# Altium project MINIRACER.PrjPCB
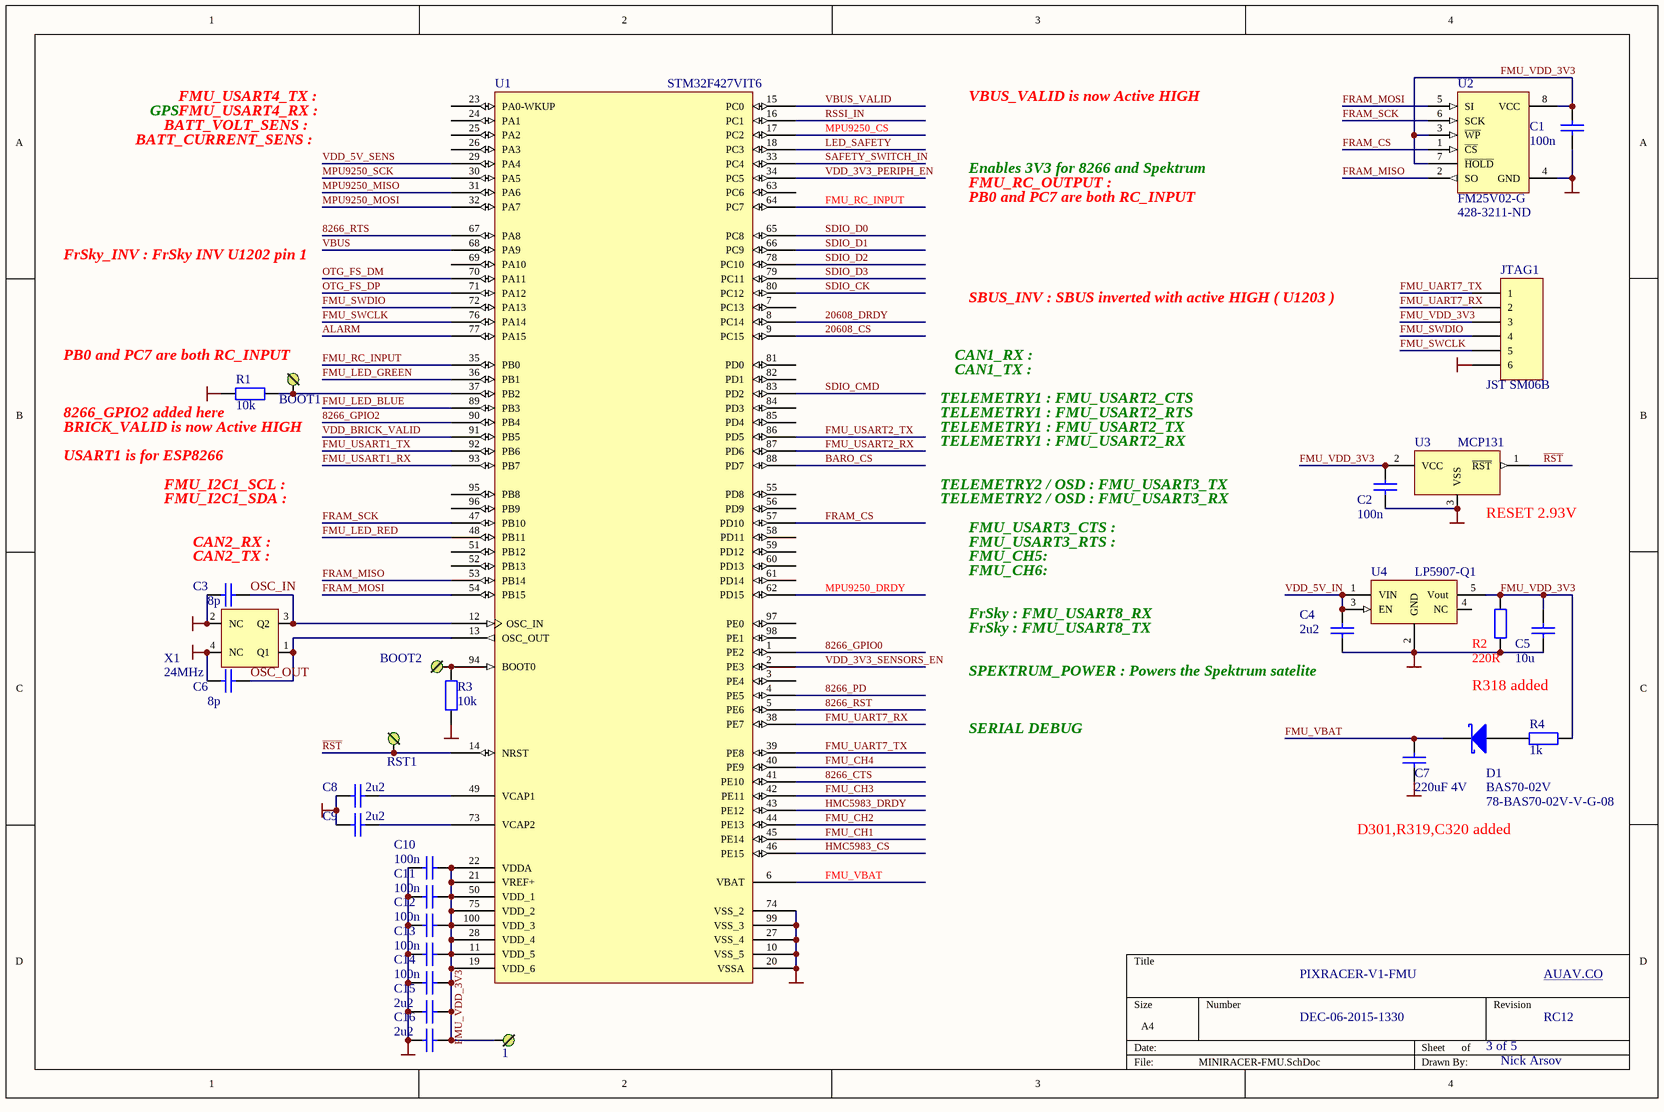
[diagram p0: MINIRACER-FMU.SchDoc]
5 sheets, 108 parts. Net scope: global (net labels, ports and power ports of the same name join across sheets).
Board file: MINIRACER.PcbDoc
Sheets:
  MINIRACER-FMU.SchDoc
  MINIRACER-IMU.SchDoc
  MINIRACER-POWER.SchDoc
  MINIRACER-SD-USB.SchDoc
  MINIRACER-SERIALS.SchDoc

## Sheet MINIRACER-FMU.SchDoc
size A4

### Parts
1  3V3  [PAD1]  (value not drawn)
BOOT1  BOOT1  [PAD1]  (value not drawn)
BOOT2  BOOT  [PAD1]  (value not drawn)
C1  100n  [0402A]
C2  100n  [0402A]
C3  8p  [0603A]
C4  2u2  [0603A]
C5  10u  [0603A]
C6  8p  [0603A]
C7  220uF 4V  [1206A]
C8  2u2  [0402A]
C9  2u2  [0402A]
C10  100n  [0402A]
C11  100n  [0402A]
C12  100n  [0402A]
C13  100n  [0402A]
C14  100n  [0402A]
C15  2u2  [0402A]
C16  2u2  [0402A]
D1  BAS70-02V  Mouser: 78-BAS70-02V-V-G-08  [SOD-523]
JTAG1  JST SM06B  [HDR1X6]
R1  10k  [0402A]
R2  220R  [0603A]
R3  10k  [0402A]
R4  1k  [0603A]
RST1  BOOT  [PAD1]  (value not drawn)
U1  STM32F427VIT6  [LQFP100_L]
U2  FM25V02-G  Supplier Part Number: 428-3211-ND  [SO-8_N]
U3  MCP131  [SOT-323]
U4  LP5907-Q1  [SOT23-5]
X1  24MHz  [Crystal_2.5x2]

### Nets
FMU_VDD_3V3: 1.1 C1.2 C2.2 C5.2 C10.2 C11.2 C12.2 C13.2 C14.2 C15.2 C16.2 JTAG1.3 R2.2 R4.1 U1.11(VDD_5) U1.19(VDD_6) U1.21(VREF+) U1.22(VDDA) U1.28(VDD_4) U1.50(VDD_1) U1.75(VDD_2) U1.100(VDD_3) U2.3(~{WP}) U2.7(~{HOLD}) U2.8(VCC) U3.2(VCC) U4.5(Vout)
GND: C1.1 C2.1 C3.1 C4.1 C5.1 C6.1 C7.1 C8.2 C9.2 C10.1 C11.1 C12.1 C13.1 C14.1 C15.1 C16.1 JTAG1.6 R1.1 R2.1 R3.2 U1.10(VSS_5) U1.20(VSSA) U1.27(VSS_4) U1.74(VSS_2) U1.99(VSS_3) U2.4(GND) U3.3(VSS) U4.2(GND) X1.2(NC) X1.4(NC)
8266_CTS: U1.41(PE10)
8266_GPIO0: U1.1(PE2)
8266_GPIO2: U1.90(PB4)
8266_PD: U1.4(PE5)
8266_RST: U1.5(PE6)
8266_RTS: U1.67(PA8)
20608_CS: U1.9(PC15)
20608_DRDY: U1.8(PC14)
~{RST}: RST1.1 U1.14(NRST) U3.1(~{RST})
ALARM: U1.77(PA15)
BARO_CS: U1.88(PD7)
FMU_CH1: U1.45(PE14)
FMU_CH2: U1.44(PE13)
FMU_CH3: U1.42(PE11)
FMU_CH4: U1.40(PE9)
FMU_LED_BLUE: U1.89(PB3)
FMU_LED_GREEN: U1.36(PB1)
FMU_LED_RED: U1.48(PB11)
FMU_RC_INPUT: U1.35(PB0) U1.64(PC7)
FMU_SWCLK: JTAG1.5 U1.76(PA14)
FMU_SWDIO: JTAG1.4 U1.72(PA13)
FMU_UART7_RX: JTAG1.2 U1.38(PE7)
FMU_UART7_TX: JTAG1.1 U1.39(PE8)
FMU_USART1_RX: U1.93(PB7)
FMU_USART1_TX: U1.92(PB6)
FMU_USART2_RX: U1.87(PD6)
FMU_USART2_TX: U1.86(PD5)
FMU_VBAT: C7.2 D1.2(K) U1.6(VBAT)
FRAM_CS: U1.57(PD10) U2.1(~{CS})
FRAM_MISO: U1.53(PB14) U2.2(SO)
FRAM_MOSI: U1.54(PB15) U2.5(SI)
FRAM_SCK: U1.47(PB10) U2.6(SCK)
HMC5983_CS: U1.46(PE15)
HMC5983_DRDY: U1.43(PE12)
LED_SAFETY: U1.18(PC3)
MPU9250_CS: U1.17(PC2)
MPU9250_DRDY: U1.62(PD15)
MPU9250_MISO: U1.31(PA6)
MPU9250_MOSI: U1.32(PA7)
MPU9250_SCK: U1.30(PA5)
OSC_IN: C3.2 U1.12(OSC_IN) X1.3(Q2)
OSC_OUT: C6.2 U1.13(OSC_OUT) X1.1(Q1)
OTG_FS_DM: U1.70(PA11)
OTG_FS_DP: U1.71(PA12)
RSSI_IN: U1.16(PC1)
SAFETY_SWITCH_IN: U1.33(PC4)
SDIO_CK: U1.80(PC12)
SDIO_CMD: U1.83(PD2)
SDIO_D0: U1.65(PC8)
SDIO_D1: U1.66(PC9)
SDIO_D2: U1.78(PC10)
SDIO_D3: U1.79(PC11)
VBUS: U1.68(PA9)
VBUS_VALID: U1.15(PC0)
VDD_3V3_PERIPH_EN: U1.34(PC5)
VDD_3V3_SENSORS_EN: U1.2(PE3)
VDD_5V_IN: C4.2 U4.1(VIN) U4.3(EN)
VDD_5V_SENS: U1.29(PA4)
VDD_BRICK_VALID: U1.91(PB5)
NetBOOT1_1: BOOT1.1 R1.2 U1.37(PB2)
NetBOOT2_1: BOOT2.1 R3.1 U1.94(BOOT0)
NetC8_1: C8.1 U1.49(VCAP1)
NetC9_1: C9.1 U1.73(VCAP2)
NetD1_1: D1.1(A) R4.2

Not connected (* = marked no-connect by the designer): U1 3(PE4) 7(PC13) 23(PA0-WKUP) 24(PA1) 25(PA2) 26(PA3) 51(PB12) 52(PB13) 55(PD8) 56(PD9) 58(PD11) 59(PD12) 60(PD13) 61(PD14) 63(PC6) 69(PA10) 81(PD0) 82(PD1) 84(PD3) 85(PD4) 95(PB8) 96(PB9) 97(PE0) 98(PE1); U4 4(NC)

### Notes on the sheet
- GPS
- FMU_USART4_TX :
- FMU_USART4_RX :
- VBUS_VALID is now Active HIGH
- BATT_CURRENT_SENS :
- BATT_VOLT_SENS :
- Enables 3V3 for 8266 and Spektrum
- FMU_RC_OUTPUT :
- FrSky_INV : FrSky INV U1202 pin 1
- PB0 and PC7 are both RC_INPUT
- SBUS_INV : SBUS inverted with active HIGH ( U1203 )
- (near BOOT1) PB0 and PC7 are both RC_INPUT
- TELEMETRY1 : FMU_USART2_CTS
- CAN1_RX :
- CAN1_TX :
- (near R1) USART1 is for ESP8266
- BRICK_VALID is now Active HIGH
- (near R1) 8266_GPIO2 added here
- TELEMETRY1 : FMU_USART2_TX
- TELEMETRY1 : FMU_USART2_RX
- TELEMETRY1 : FMU_USART2_RTS
- FMU_I2C1_SCL :
- FMU_I2C1_SDA :
- (near C3) CAN2_RX :
- TELEMETRY2 / OSD : FMU_USART3_TX
- TELEMETRY2 / OSD : FMU_USART3_RX
- FMU_USART3_CTS :
- FMU_USART3_RTS :
- (near U3) RESET 2.93V
- (near C3) CAN2_TX :
- FrSky : FMU_USART8_RX
- FMU_CH6:
- FMU_CH5:
- (near C4) SPEKTRUM_POWER : Powers the Spektrum satelite
- FrSky : FMU_USART8_TX
- R318 added
- SERIAL DEBUG
- D301,R319,C320 added
- PIXRACER-V1-FMU
- AUAV.CO
- DEC-06-2015-1330
- 3 of 5
- RC12
- Nick Arsov

### Library data of the parts
1 BOOT1 BOOT2 RST1 = PLUG
C1-C16 = Cap: Capacitor; Value: 100pF; Published: 8-Jun-2000; LatestRevisionDate: 17-Jul-2002; LatestRevisionNote: Re-released for DXP Platform.; PackageReference: RAD-0.3; Publisher: Altium Limited
  C7: PackageDescription: Radial Cap, Thru-Hole; 2 Leads; 0.3 in Pin Spacing
D1 = D Schottky: Schottky Diode; Published: 8-Jun-2000; LatestRevisionDate: 17-Jul-2002; LatestRevisionNote: Re-released for DXP Platform.; PackageReference: SMB; Publisher: Altium Limited; PackageDescription: DO-214-AA/SMB; 2 C-Bend Leads; Body 5.3 x 3.6 mm, inc. leads (LxW); Code_JEDEC: DO-214-AA
JTAG1 = Header 6: Header, 6-Pin; LatestRevisionDate: 17-Jul-2002; LatestRevisionNote: Re-released for DXP Platform.; Publisher: Altium Limited
R1-R3 = Res2: Resistor; Value: 1K; Published: 8-Jun-2000; LatestRevisionDate: 17-Jul-2002; LatestRevisionNote: Re-released for DXP Platform.; PackageReference: AXIAL-0.4; Publisher: Altium Limited; PackageDescription: Axial Device, Thru-Hole; 2 Leads; 0.4 in Pin Spacing
R4 = Res2: Resistor; Published: 8-Jun-2000; LatestRevisionDate: 17-Jul-2002; LatestRevisionNote: Re-released for DXP Platform.; PackageReference: AXIAL-0.4; Publisher: Altium Limited; PackageDescription: Axial Device, Thru-Hole; 2 Leads; 0.4 in Pin Spacing; Value: 1K
U1 = STM32F103VBT6: STM32 ARM-based 32-bit MCU with 64 Kbytes Flash, 100-pin LQFP, Industrial Temperature; Published: 30-May-2008; DatasheetVersion: rev6, Mar-2008; PackageVersion: Mar-2008; PackageReference: LQFP100; Publisher: Altium Limited; PackageDescription: 100-Pin Low-Profile Quad Flat Pack, 14 x 14 mm Body, 0.5 mm Pitch (LQFP100); ComponentLink1Description: Manufacturer Link; ComponentLink1URL: www.st.com/stm32; ComponentLink2Description: Datasheet; ComponentLink2URL: http://www.st.com/stonline/products/literature/ds/13587.pdf
U2 = AT45DB161D-MU
U3 = MCP102
X1 = Crystal_4pin: Supplier Part Number: 644-1052-1-ND

## Sheet MINIRACER-IMU.SchDoc
size A4; PageSetup: Record=PageOptions|CenterHorizontal=True|CenterVertical=True|PrintScale=0.97|XCorrection=1.00|YCorrection=1.00|PrintKind=2|BorderSize=5000000|LeftOffset=0|BottomOffset=0|Orientation=2|PaperLength=1000|PaperWidth=1000|Scale=100|PaperSource=7|PrintQuality=-4|MediaType=1|DitherType=10|PaperKind=A4|PrintScaleMode=1
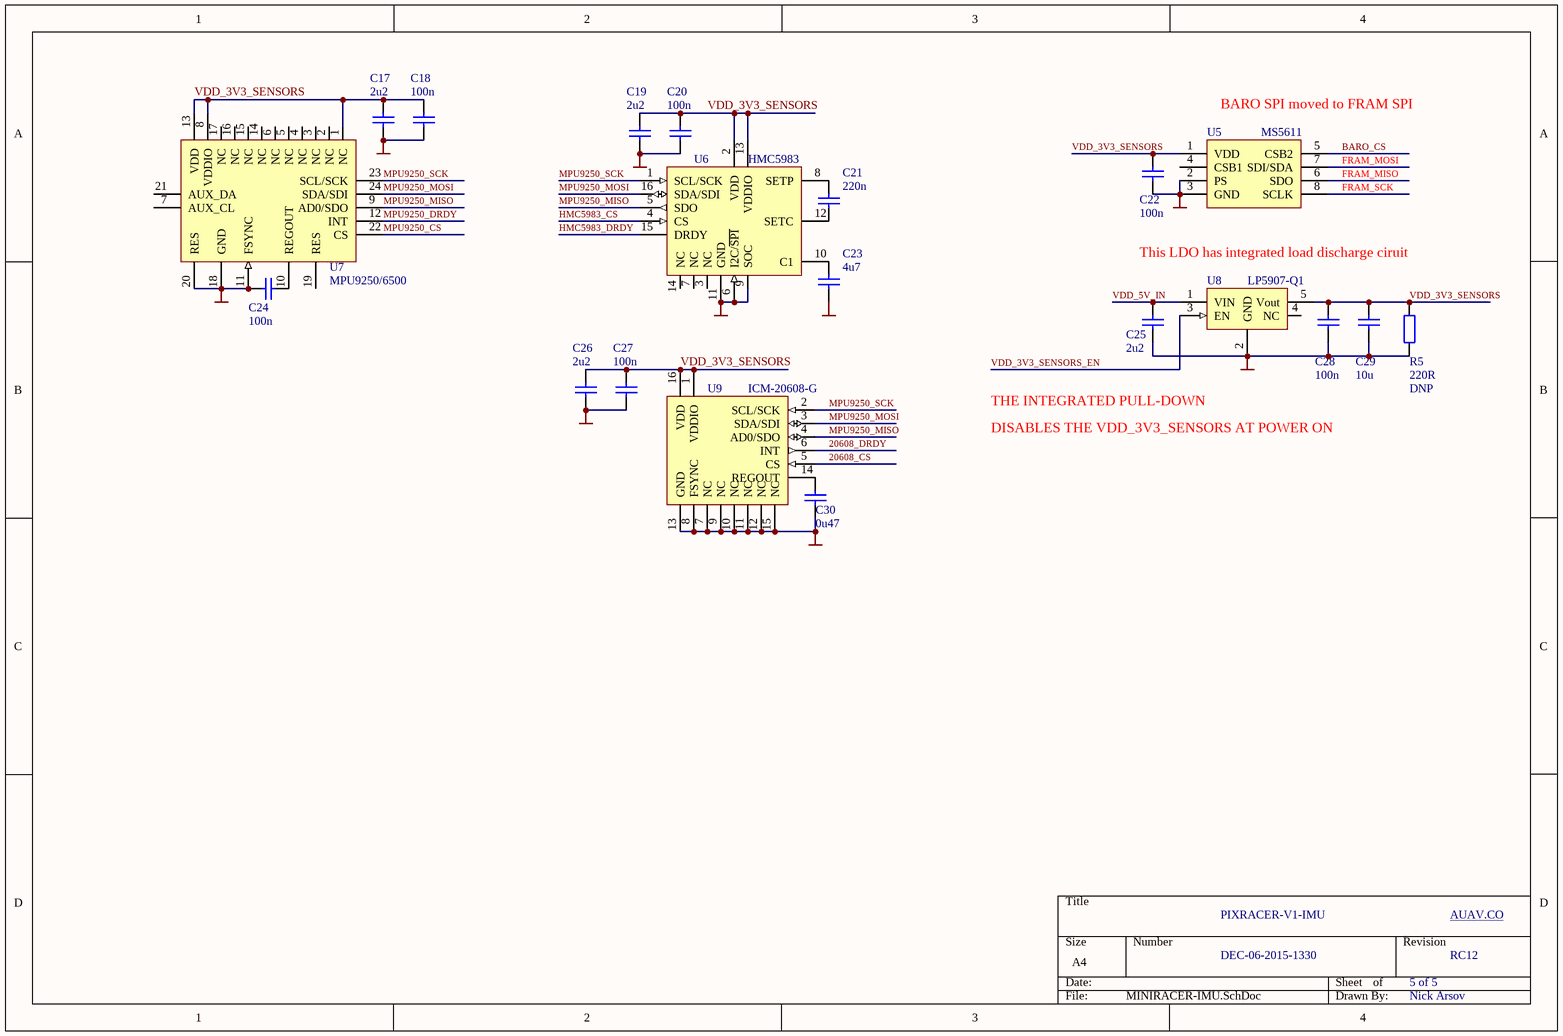
[diagram p1: MINIRACER-IMU.SchDoc]

### Parts
C17  2u2  [0402A]
C18  100n  [0402A]
C19  2u2  [0402A]
C20  100n  [0402A]
C21  220n  [0402A]
C22  100n  [0402A]
C23  4u7  [0603A]
C24  100n  [0402A]
C25  2u2  [0603A]
C26  2u2  [0402A]
C27  100n  [0402A]
C28  100n  [0603A]
C29  10u  [0603A]
C30  0u47  [0402A]
R5  220R  REM: DNP  [0402A]
U5  MS5611  [MS5611]
U6  HMC5983  [HMC5883L]
U7  MPU9250/6500  [MPU6500-9250]
U8  LP5907-Q1  [SOT23-5]
U9  ICM-20608-G  [HCLGA-16L]

### Nets
GND: C17.1 C18.1 C19.1 C20.1 C22.1 C23.1 C24.1 C25.1 C26.1 C27.1 C28.1 C29.1 C30.1 R5.1 U5.2(PS) U5.3(GND) U6.6(I2C/~{SPI}) U6.9(SOC) U6.11(GND) U7.11(FSYNC) U7.18(GND) U7.20(RES) U8.2(GND) U9.7(NC) U9.8(FSYNC) U9.9(NC) U9.10(NC) U9.11(NC) U9.12(NC) U9.13(GND) U9.15(NC)
20608_CS: U9.5(CS)
20608_DRDY: U9.6(INT)
BARO_CS: U5.5(CSB2)
FRAM_MISO: U5.6(SDO)
FRAM_MOSI: U5.7(SDI/SDA)
FRAM_SCK: U5.8(SCLK)
HMC5983_CS: U6.4(CS)
HMC5983_DRDY: U6.15(DRDY)
MPU9250_CS: U7.22(CS)
MPU9250_DRDY: U7.12(INT)
MPU9250_MISO: U6.5(SDO) U7.9(AD0/SDO) U9.4(AD0/SDO)
MPU9250_MOSI: U6.16(SDA/SDI) U7.24(SDA/SDI) U9.3(SDA/SDI)
MPU9250_SCK: U6.1(SCL/SCK) U7.23(SCL/SCK) U9.2(SCL/SCK)
VDD_3V3_SENSORS: C17.2 C18.2 C19.2 C20.2 C22.2 C26.2 C27.2 C28.2 C29.2 R5.2 U5.1(VDD) U6.2(VDD) U6.13(VDDIO) U7.1(NC) U7.8(VDDIO) U7.13(VDD) U8.5(Vout) U9.1(VDDIO) U9.16(VDD)
VDD_3V3_SENSORS_EN: U8.3(EN)
VDD_5V_IN: C25.2 U8.1(VIN)
NetC21_1: C21.1 U6.12(SETC)
NetC21_2: C21.2 U6.8(SETP)
NetC23_2: C23.2 U6.10(C1)
NetC24_2: C24.2 U7.10(REGOUT)
NetC30_2: C30.2 U9.14(REGOUT)

Not connected (* = marked no-connect by the designer): U5 4(CSB1); U6 3(NC) 7(NC) 14(NC); U7 2(NC) 3(NC) 4(NC) 5(NC) 6(NC) 7(AUX_CL) 14(NC) 15(NC) 16(NC) 17(NC) 19(RES) 21(AUX_DA); U8 4(NC)

### Notes on the sheet
- (near U5) BARO SPI moved to FRAM SPI
- This LDO has integrated load discharge ciruit
- THE INTEGRATED PULL-DOWN
- DISABLES THE VDD_3V3_SENSORS AT POWER ON
- PIXRACER-V1-IMU
- AUAV.CO
- DEC-06-2015-1330
- 5 of 5
- RC12
- Nick Arsov

### Library data of the parts
C17-C30 = Cap: Capacitor; Value: 100pF; Published: 8-Jun-2000; LatestRevisionDate: 17-Jul-2002; LatestRevisionNote: Re-released for DXP Platform.; PackageReference: RAD-0.3; Publisher: Altium Limited
R5 = Res2: Resistor; Value: 1K; Published: 8-Jun-2000; LatestRevisionDate: 17-Jul-2002; LatestRevisionNote: Re-released for DXP Platform.; PackageReference: AXIAL-0.4; Publisher: Altium Limited; PackageDescription: Axial Device, Thru-Hole; 2 Leads; 0.4 in Pin Spacing
U5 = MS5611-01BA03
U7 = MPU6500

## Sheet MINIRACER-POWER.SchDoc
size A4
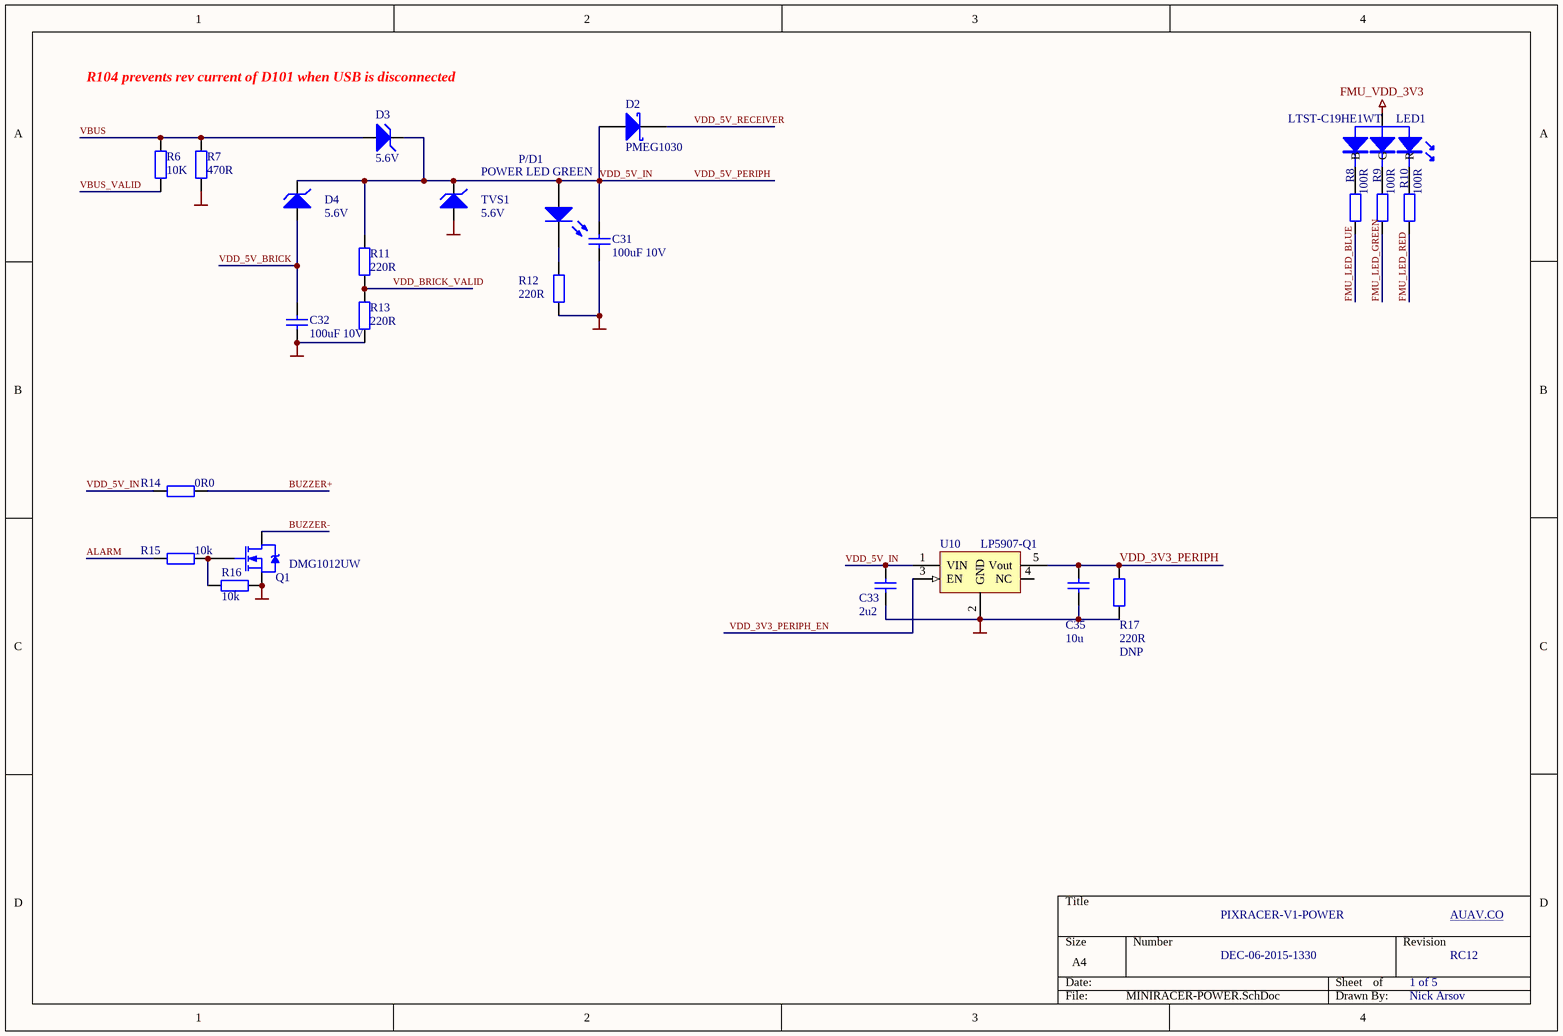
[diagram p2: MINIRACER-POWER.SchDoc]

### Parts
C31  100uF 10V  [0805A]
C32  100uF 10V  [0805A]
C33  2u2  [0603A]
C35  10u  [0603A]
D2  PMEG1030  [sod323f]
D3  5.6V  [SOD123F]
D4  5.6V  [SOD123F]
LED1  LTST-C19HE1WT  [LTST-C19HE1WT]
P/D1  POWER LED GREEN  [0603A]
Q1  DMG1012UW  [2N7002-SOT323]
R6  10K  [0603A]
R7  470R  [0603A]
R8  100R  [0402A]
R9  100R  [0402A]
R10  100R  [0402A]
R11  220R  [0603A]
R12  220R  [0603A]
R13  220R  [0603A]
R14  0R0  [0402A]
R15  10k  [0402A]
R16  10k  [0402A]
R17  220R  REM: DNP  [0402A]
TVS1  5.6V  [SOD123F]
U10  LP5907-Q1  [SOT23-5]

### Nets
FMU_VDD_3V3: LED1.4(A)
GND: C31.1 C32.1 C33.1 C35.1 Q1.2(S) R7.1 R12.1 R13.2 R16.2 R17.1 TVS1.1(A) U10.2(GND)
ALARM: R15.2
BUZZER+: R14.1
BUZZER-: Q1.1(D)
FMU_LED_BLUE: R8.1
FMU_LED_GREEN: R9.1
FMU_LED_RED: R10.1
VBUS: D3.1(A) R6.2 R7.2
VBUS_VALID: R6.1
VDD_3V3_PERIPH: C35.2 R17.2 U10.5(Vout)
VDD_3V3_PERIPH_EN: U10.3(EN)
VDD_5V_BRICK: C32.2 D4.1(A)
VDD_5V_IN: C31.2 C33.2 D2.1(A) D3.2(K) D4.2(K) P/D1.1(A) R11.1 R14.2 TVS1.2(K) U10.1(VIN)  [also labelled VDD_5V_PERIPH]
VDD_5V_RECEIVER: D2.2(K)
VDD_BRICK_VALID: R11.2 R13.1
NetLED1_1: LED1.1(R) R10.2
NetLED1_2: LED1.2(G) R9.2
NetLED1_3: LED1.3(B) R8.2
NetP/D1_2: P/D1.2(K) R12.2
NetQ1_3: Q1.3(G) R15.1 R16.1

Not connected (* = marked no-connect by the designer): U10 4(NC)

### Notes on the sheet
- R104 prevents rev current of D101 when USB is disconnected
- PIXRACER-V1-POWER
- AUAV.CO
- DEC-06-2015-1330
- 1 of 5
- RC12
- Nick Arsov

### Library data of the parts
C31-C33 C35 = Cap: Capacitor; Value: 100pF; Published: 8-Jun-2000; LatestRevisionDate: 17-Jul-2002; LatestRevisionNote: Re-released for DXP Platform.; PackageReference: RAD-0.3; Publisher: Altium Limited
  C31 C32: PackageDescription: Radial Cap, Thru-Hole; 2 Leads; 0.3 in Pin Spacing
D2 = D Schottky: Schottky Diode; Published: 8-Jun-2000; LatestRevisionDate: 17-Jul-2002; LatestRevisionNote: Re-released for DXP Platform.; PackageReference: SMB; Publisher: Altium Limited; PackageDescription: DO-214-AA/SMB; 2 C-Bend Leads; Body 5.3 x 3.6 mm, inc. leads (LxW); Code_JEDEC: DO-214-AA
D3 D4 TVS1 = D Zener: Zener Diode; Published: 8-Jun-2000; LatestRevisionDate: 17-Jul-2002; LatestRevisionNote: Re-released for DXP Platform.; PackageReference: DIODE-0.7; Publisher: Altium Limited; PackageDescription: Diode, Thru-Hole; 2 Leads; 0.7 in Pin Spacing
LED1 = RGB_LED_5MM
P/D1 = LED0: Typical INFRARED GaAs LED; Published: 8-Jun-2000; LatestRevisionDate: 08-Jul-2005; LatestRevisionNote: Mech Layer 1 removed.; PackageReference: LED-0; Publisher: Altium Limited; PackageDescription: LED; 2 Leads
Q1 = NMOS-2: N-Channel Power MOSFET; Note: Pin 2 is electrically connected to pin 4.; Published: 8-Jun-2000; LatestRevisionDate: 17-Jul-2002; LatestRevisionNote: Re-released for DXP Platform.; DatasheetDocument: PD-9.814; PackageReference: TO-220AB; Publisher: Altium Limited; Code_JEDEC: TO-220-AB; ComponentLink1Description: Manufacturer Link; ComponentLink1URL: http://www.irf.com/
R6-R17 = Res2: Resistor; Value: 1K; Published: 8-Jun-2000; LatestRevisionDate: 17-Jul-2002; LatestRevisionNote: Re-released for DXP Platform.; PackageReference: AXIAL-0.4; Publisher: Altium Limited
  R6 R7 R11-R17: PackageDescription: Axial Device, Thru-Hole; 2 Leads; 0.4 in Pin Spacing

## Sheet MINIRACER-SD-USB.SchDoc
size A4
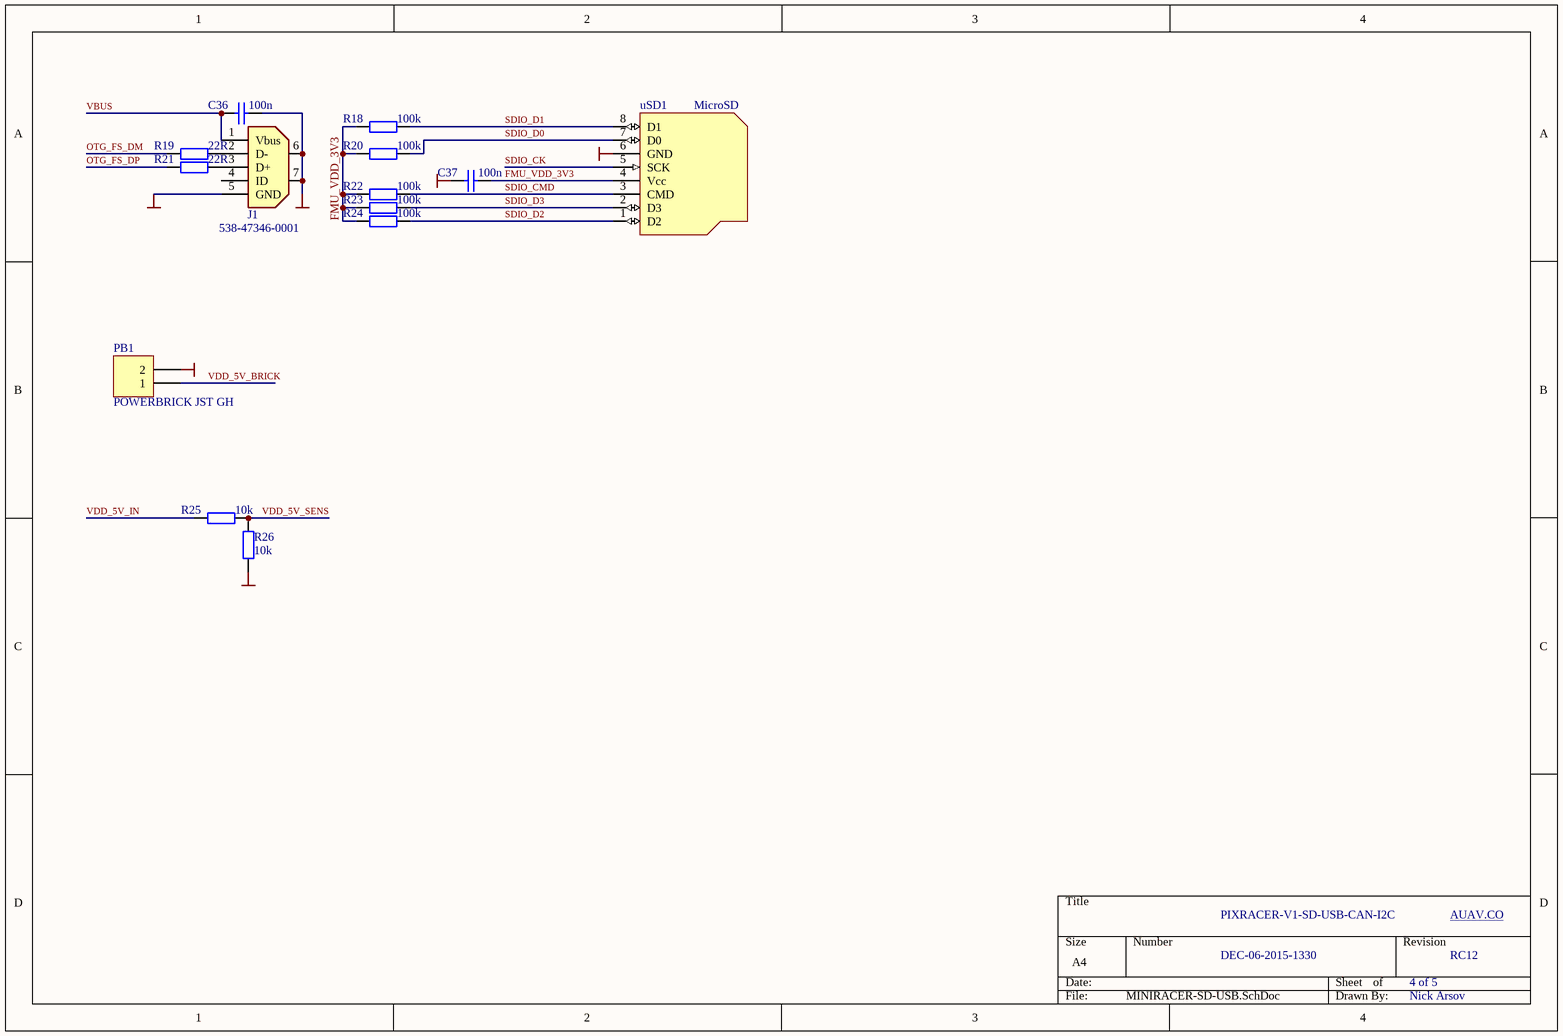
[diagram p3: MINIRACER-SD-USB.SchDoc]

### Parts
C36  100n  [0402A]
C37  100n  [0402A]
J1  Mouser Part Number: 538-47346-0001  [USBmicro_B]  (hidden comment: miniUSB)
PB1  POWERBRICK JST GH  [HDR1X2]
R18  100k  [0402A]
R19  22R  [0402A]
R20  100k  [0402A]
R21  22R  [0402A]
R22  100k  [0402A]
R23  100k  [0402A]
R24  100k  [0402A]
R25  10k  [0402A]
R26  10k  [0402A]
uSD1  MicroSD  [MicroSD_China_01]

### Nets
FMU_VDD_3V3: C37.1 R18.2 R20.2 R22.2 R23.2 R24.2 uSD1.4(Vcc)
GND: C36.1 C37.2 J1.5(GND) J1.6(GND) J1.7(GND) PB1.2 R26.2 uSD1.6(GND)
OTG_FS_DM: R19.2
OTG_FS_DP: R21.2
SDIO_CK: uSD1.5(SCK)
SDIO_CMD: R22.1 uSD1.3(CMD)
SDIO_D0: R20.1 uSD1.7(D0)
SDIO_D1: R18.1 uSD1.8(D1)
SDIO_D2: R24.1 uSD1.1(D2)
SDIO_D3: R23.1 uSD1.2(D3)
VBUS: C36.2 J1.1(Vbus)
VDD_5V_BRICK: PB1.1
VDD_5V_IN: R25.2
VDD_5V_SENS: R25.1 R26.1
NetJ1_2: J1.2(D-) R19.1
NetJ1_3: J1.3(D+) R21.1

Not connected (* = marked no-connect by the designer): J1 4(ID)

### Notes on the sheet
- PIXRACER-V1-SD-USB-CAN-I2C
- AUAV.CO
- DEC-06-2015-1330
- 4 of 5
- RC12
- Nick Arsov

### Library data of the parts
C36 C37 = Cap: Capacitor; Value: 100pF; Published: 8-Jun-2000; LatestRevisionDate: 17-Jul-2002; LatestRevisionNote: Re-released for DXP Platform.; PackageReference: RAD-0.3; Publisher: Altium Limited
J1 = MicroUSB
PB1 = Header 2: Header, 2-Pin; LatestRevisionDate: 17-Jul-2002; LatestRevisionNote: Re-released for DXP Platform.; Publisher: Altium Limited
R18-R26 = Res2: Resistor; Value: 1K; Published: 8-Jun-2000; LatestRevisionDate: 17-Jul-2002; LatestRevisionNote: Re-released for DXP Platform.; PackageReference: AXIAL-0.4; Publisher: Altium Limited; PackageDescription: Axial Device, Thru-Hole; 2 Leads; 0.4 in Pin Spacing

## Sheet MINIRACER-SERIALS.SchDoc
size A4
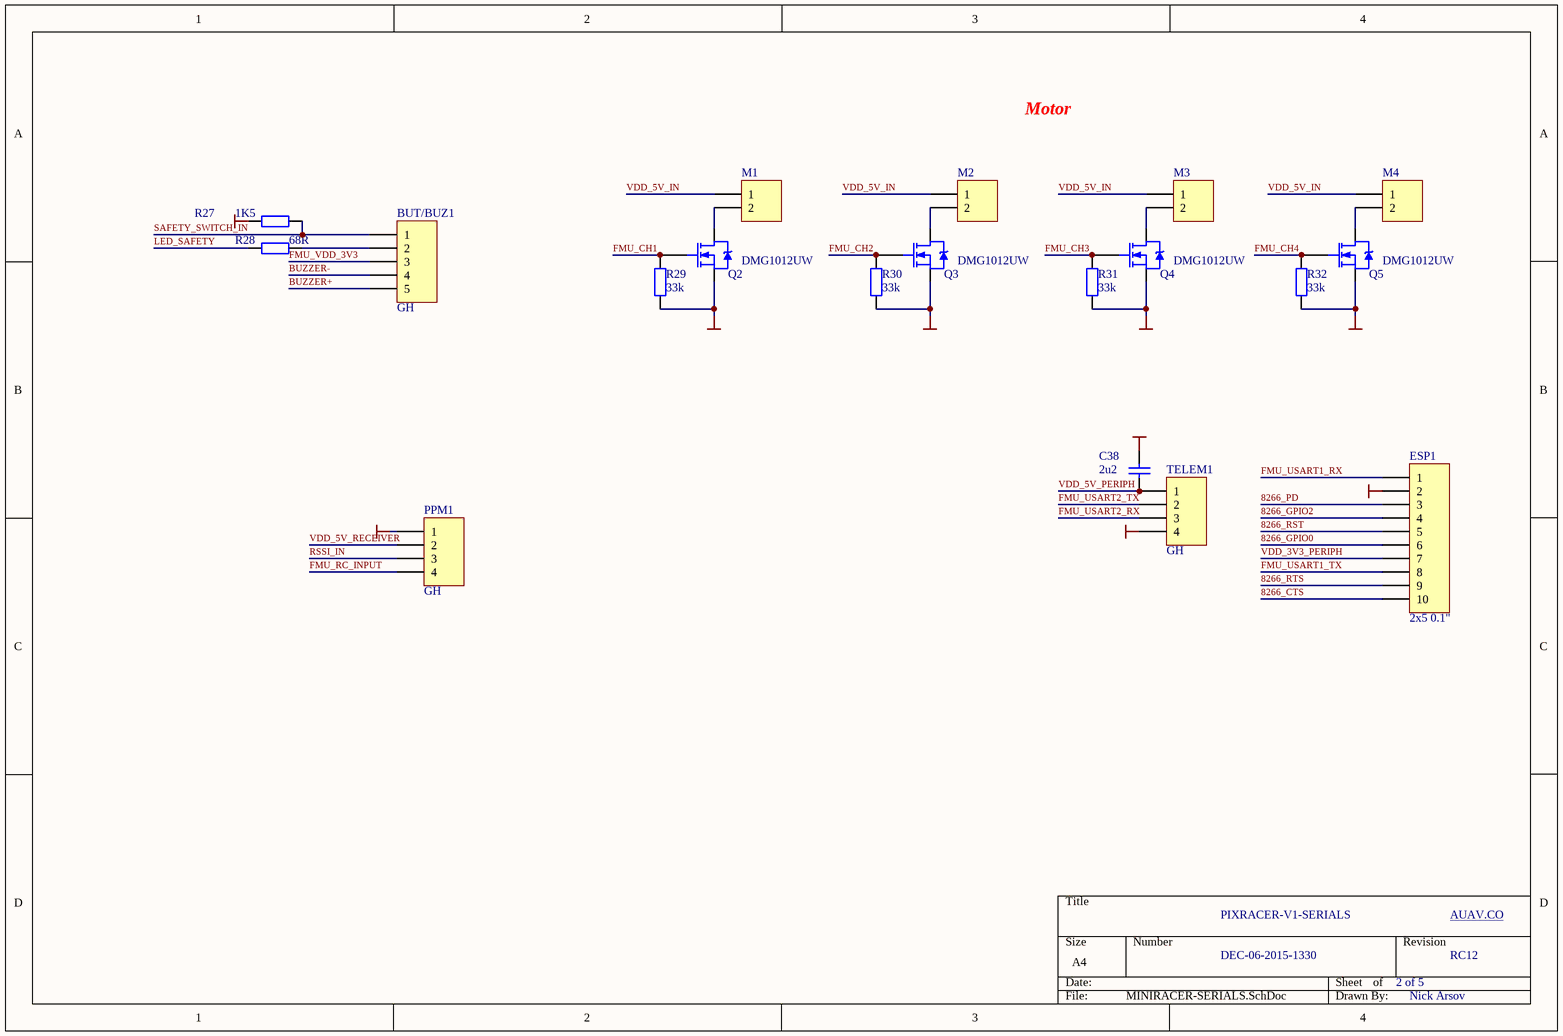
[diagram p4: MINIRACER-SERIALS.SchDoc]

### Parts
BUT/BUZ1  GH  [HDR1X5]
C38  2u2  [0402A]
ESP1  2x5 0.1"  [2.54mm_10pin_SMD]
M1  (no value)  [HDR1X2]
M2  (no value)  [HDR1X2]
M3  (no value)  [HDR1X2]
M4  (no value)  [HDR1X2]
PPM1  GH  [HDR1X4]
Q2  DMG1012UW  [2N7002-SOT323]
Q3  DMG1012UW  [2N7002-SOT323]
Q4  DMG1012UW  [2N7002-SOT323]
Q5  DMG1012UW  [2N7002-SOT323]
R27  1K5  [0402A]
R28  68R  [0402A]
R29  33k  [0402A]
R30  33k  [0402A]
R31  33k  [0402A]
R32  33k  [0402A]
TELEM1  GH  [HDR1X4]

### Nets
FMU_VDD_3V3: BUT/BUZ1.3
GND: C38.2 ESP1.2 PPM1.1 Q2.2(S) Q3.2(S) Q4.2(S) Q5.2(S) R27.2 R29.2 R30.2 R31.2 R32.2 TELEM1.4
8266_CTS: ESP1.10
8266_GPIO0: ESP1.6
8266_GPIO2: ESP1.4
8266_PD: ESP1.3
8266_RST: ESP1.5
8266_RTS: ESP1.9
BUZZER+: BUT/BUZ1.5
BUZZER-: BUT/BUZ1.4
FMU_CH1: Q2.3(G) R29.1
FMU_CH2: Q3.3(G) R30.1
FMU_CH3: Q4.3(G) R31.1
FMU_CH4: Q5.3(G) R32.1
FMU_RC_INPUT: PPM1.4
FMU_USART1_RX: ESP1.1
FMU_USART1_TX: ESP1.8
FMU_USART2_RX: TELEM1.3
FMU_USART2_TX: TELEM1.2
LED_SAFETY: R28.2
RSSI_IN: PPM1.3
SAFETY_SWITCH_IN: BUT/BUZ1.1 R27.1
VDD_3V3_PERIPH: ESP1.7
VDD_5V_IN: C38.1 M1.1 M2.1 M3.1 M4.1 TELEM1.1  [also labelled VDD_5V_PERIPH]
VDD_5V_RECEIVER: PPM1.2
NetBUT/BUZ1_2: BUT/BUZ1.2 R28.1
NetM1_2: M1.2 Q2.1(D)
NetM2_2: M2.2 Q3.1(D)
NetM3_2: M3.2 Q4.1(D)
NetM4_2: M4.2 Q5.1(D)

### Notes on the sheet
- Motor
- PIXRACER-V1-SERIALS
- AUAV.CO
- DEC-06-2015-1330
- 2 of 5
- RC12
- Nick Arsov

### Library data of the parts
BUT/BUZ1 = Header 5: Header, 5-Pin; LatestRevisionDate: 17-Jul-2002; LatestRevisionNote: Re-released for DXP Platform.; Publisher: Altium Limited
C38 = Cap: Capacitor; Value: 100pF; Published: 8-Jun-2000; LatestRevisionDate: 17-Jul-2002; LatestRevisionNote: Re-released for DXP Platform.; PackageReference: RAD-0.3; Publisher: Altium Limited
ESP1 = Header 10: Header, 10-Pin; LatestRevisionDate: 17-Jul-2002; LatestRevisionNote: Re-released for DXP Platform.; Publisher: Altium Limited
M1-M4 = Header 2: Header, 2-Pin; LatestRevisionDate: 17-Jul-2002; LatestRevisionNote: Re-released for DXP Platform.; Publisher: Altium Limited
PPM1 TELEM1 = Header 4: Header, 4-Pin; LatestRevisionDate: 17-Jul-2002; LatestRevisionNote: Re-released for DXP Platform.; Publisher: Altium Limited
Q2-Q5 = NMOS-2: as Q1 on sheet MINIRACER-POWER; Published: 8-Jun-2000; LatestRevisionDate: 17-Jul-2002; LatestRevisionNote: Re-released for DXP Platform.; DatasheetDocument: PD-9.814; PackageReference: TO-220AB; Publisher: Altium Limited; Code_JEDEC: TO-220-AB; ComponentLink1Description: Manufacturer Link; ComponentLink1URL: http://www.irf.com/
R27-R32 = Res2: Resistor; Value: 1K; Published: 8-Jun-2000; LatestRevisionDate: 17-Jul-2002; LatestRevisionNote: Re-released for DXP Platform.; PackageReference: AXIAL-0.4; Publisher: Altium Limited
  R29-R32: PackageDescription: Axial Device, Thru-Hole; 2 Leads; 0.4 in Pin Spacing

## Nets that join several sheets
FMU_VDD_3V3: MINIRACER-FMU (27 pins), MINIRACER-POWER (LED1.4), MINIRACER-SD-USB (7 pins), MINIRACER-SERIALS (BUT/BUZ1.3)
GND: MINIRACER-FMU (30 pins), MINIRACER-IMU (31 pins), MINIRACER-POWER (12 pins), MINIRACER-SD-USB (8 pins), MINIRACER-SERIALS (13 pins)
8266_CTS: MINIRACER-FMU (U1.41), MINIRACER-SERIALS (ESP1.10)
8266_GPIO0: MINIRACER-FMU (U1.1), MINIRACER-SERIALS (ESP1.6)
8266_GPIO2: MINIRACER-FMU (U1.90), MINIRACER-SERIALS (ESP1.4)
8266_PD: MINIRACER-FMU (U1.4), MINIRACER-SERIALS (ESP1.3)
8266_RST: MINIRACER-FMU (U1.5), MINIRACER-SERIALS (ESP1.5)
8266_RTS: MINIRACER-FMU (U1.67), MINIRACER-SERIALS (ESP1.9)
20608_CS: MINIRACER-FMU (U1.9), MINIRACER-IMU (U9.5)
20608_DRDY: MINIRACER-FMU (U1.8), MINIRACER-IMU (U9.6)
ALARM: MINIRACER-FMU (U1.77), MINIRACER-POWER (R15.2)
BARO_CS: MINIRACER-FMU (U1.88), MINIRACER-IMU (U5.5)
BUZZER+: MINIRACER-POWER (R14.1), MINIRACER-SERIALS (BUT/BUZ1.5)
BUZZER-: MINIRACER-POWER (Q1.1), MINIRACER-SERIALS (BUT/BUZ1.4)
FMU_CH1: MINIRACER-FMU (U1.45), MINIRACER-SERIALS (Q2.3 R29.1)
FMU_CH2: MINIRACER-FMU (U1.44), MINIRACER-SERIALS (Q3.3 R30.1)
FMU_CH3: MINIRACER-FMU (U1.42), MINIRACER-SERIALS (Q4.3 R31.1)
FMU_CH4: MINIRACER-FMU (U1.40), MINIRACER-SERIALS (Q5.3 R32.1)
FMU_LED_BLUE: MINIRACER-FMU (U1.89), MINIRACER-POWER (R8.1)
FMU_LED_GREEN: MINIRACER-FMU (U1.36), MINIRACER-POWER (R9.1)
FMU_LED_RED: MINIRACER-FMU (U1.48), MINIRACER-POWER (R10.1)
FMU_RC_INPUT: MINIRACER-FMU (U1.35 U1.64), MINIRACER-SERIALS (PPM1.4)
FMU_USART1_RX: MINIRACER-FMU (U1.93), MINIRACER-SERIALS (ESP1.1)
FMU_USART1_TX: MINIRACER-FMU (U1.92), MINIRACER-SERIALS (ESP1.8)
FMU_USART2_RX: MINIRACER-FMU (U1.87), MINIRACER-SERIALS (TELEM1.3)
FMU_USART2_TX: MINIRACER-FMU (U1.86), MINIRACER-SERIALS (TELEM1.2)
FRAM_MISO: MINIRACER-FMU (U1.53 U2.2), MINIRACER-IMU (U5.6)
FRAM_MOSI: MINIRACER-FMU (U1.54 U2.5), MINIRACER-IMU (U5.7)
FRAM_SCK: MINIRACER-FMU (U1.47 U2.6), MINIRACER-IMU (U5.8)
HMC5983_CS: MINIRACER-FMU (U1.46), MINIRACER-IMU (U6.4)
HMC5983_DRDY: MINIRACER-FMU (U1.43), MINIRACER-IMU (U6.15)
LED_SAFETY: MINIRACER-FMU (U1.18), MINIRACER-SERIALS (R28.2)
MPU9250_CS: MINIRACER-FMU (U1.17), MINIRACER-IMU (U7.22)
MPU9250_DRDY: MINIRACER-FMU (U1.62), MINIRACER-IMU (U7.12)
MPU9250_MISO: MINIRACER-FMU (U1.31), MINIRACER-IMU (U6.5 U7.9 U9.4)
MPU9250_MOSI: MINIRACER-FMU (U1.32), MINIRACER-IMU (U6.16 U7.24 U9.3)
MPU9250_SCK: MINIRACER-FMU (U1.30), MINIRACER-IMU (U6.1 U7.23 U9.2)
OTG_FS_DM: MINIRACER-FMU (U1.70), MINIRACER-SD-USB (R19.2)
OTG_FS_DP: MINIRACER-FMU (U1.71), MINIRACER-SD-USB (R21.2)
RSSI_IN: MINIRACER-FMU (U1.16), MINIRACER-SERIALS (PPM1.3)
SAFETY_SWITCH_IN: MINIRACER-FMU (U1.33), MINIRACER-SERIALS (BUT/BUZ1.1 R27.1)
SDIO_CK: MINIRACER-FMU (U1.80), MINIRACER-SD-USB (uSD1.5)
SDIO_CMD: MINIRACER-FMU (U1.83), MINIRACER-SD-USB (R22.1 uSD1.3)
SDIO_D0: MINIRACER-FMU (U1.65), MINIRACER-SD-USB (R20.1 uSD1.7)
SDIO_D1: MINIRACER-FMU (U1.66), MINIRACER-SD-USB (R18.1 uSD1.8)
SDIO_D2: MINIRACER-FMU (U1.78), MINIRACER-SD-USB (R24.1 uSD1.1)
SDIO_D3: MINIRACER-FMU (U1.79), MINIRACER-SD-USB (R23.1 uSD1.2)
VBUS: MINIRACER-FMU (U1.68), MINIRACER-POWER (D3.1 R6.2 R7.2), MINIRACER-SD-USB (C36.2 J1.1)
VBUS_VALID: MINIRACER-FMU (U1.15), MINIRACER-POWER (R6.1)
VDD_3V3_PERIPH: MINIRACER-POWER (C35.2 R17.2 U10.5), MINIRACER-SERIALS (ESP1.7)
VDD_3V3_PERIPH_EN: MINIRACER-FMU (U1.34), MINIRACER-POWER (U10.3)
VDD_3V3_SENSORS_EN: MINIRACER-FMU (U1.2), MINIRACER-IMU (U8.3)
VDD_5V_BRICK: MINIRACER-POWER (C32.2 D4.1), MINIRACER-SD-USB (PB1.1)
VDD_5V_IN: MINIRACER-FMU (C4.2 U4.1 U4.3), MINIRACER-IMU (C25.2 U8.1), MINIRACER-POWER (10 pins), MINIRACER-SD-USB (R25.2), MINIRACER-SERIALS (6 pins)
VDD_5V_RECEIVER: MINIRACER-POWER (D2.2), MINIRACER-SERIALS (PPM1.2)
VDD_5V_SENS: MINIRACER-FMU (U1.29), MINIRACER-SD-USB (R25.1 R26.1)
VDD_BRICK_VALID: MINIRACER-FMU (U1.91), MINIRACER-POWER (R11.2 R13.1)